# EAGLE design Double_Gen (EAGLE 7.0.0)
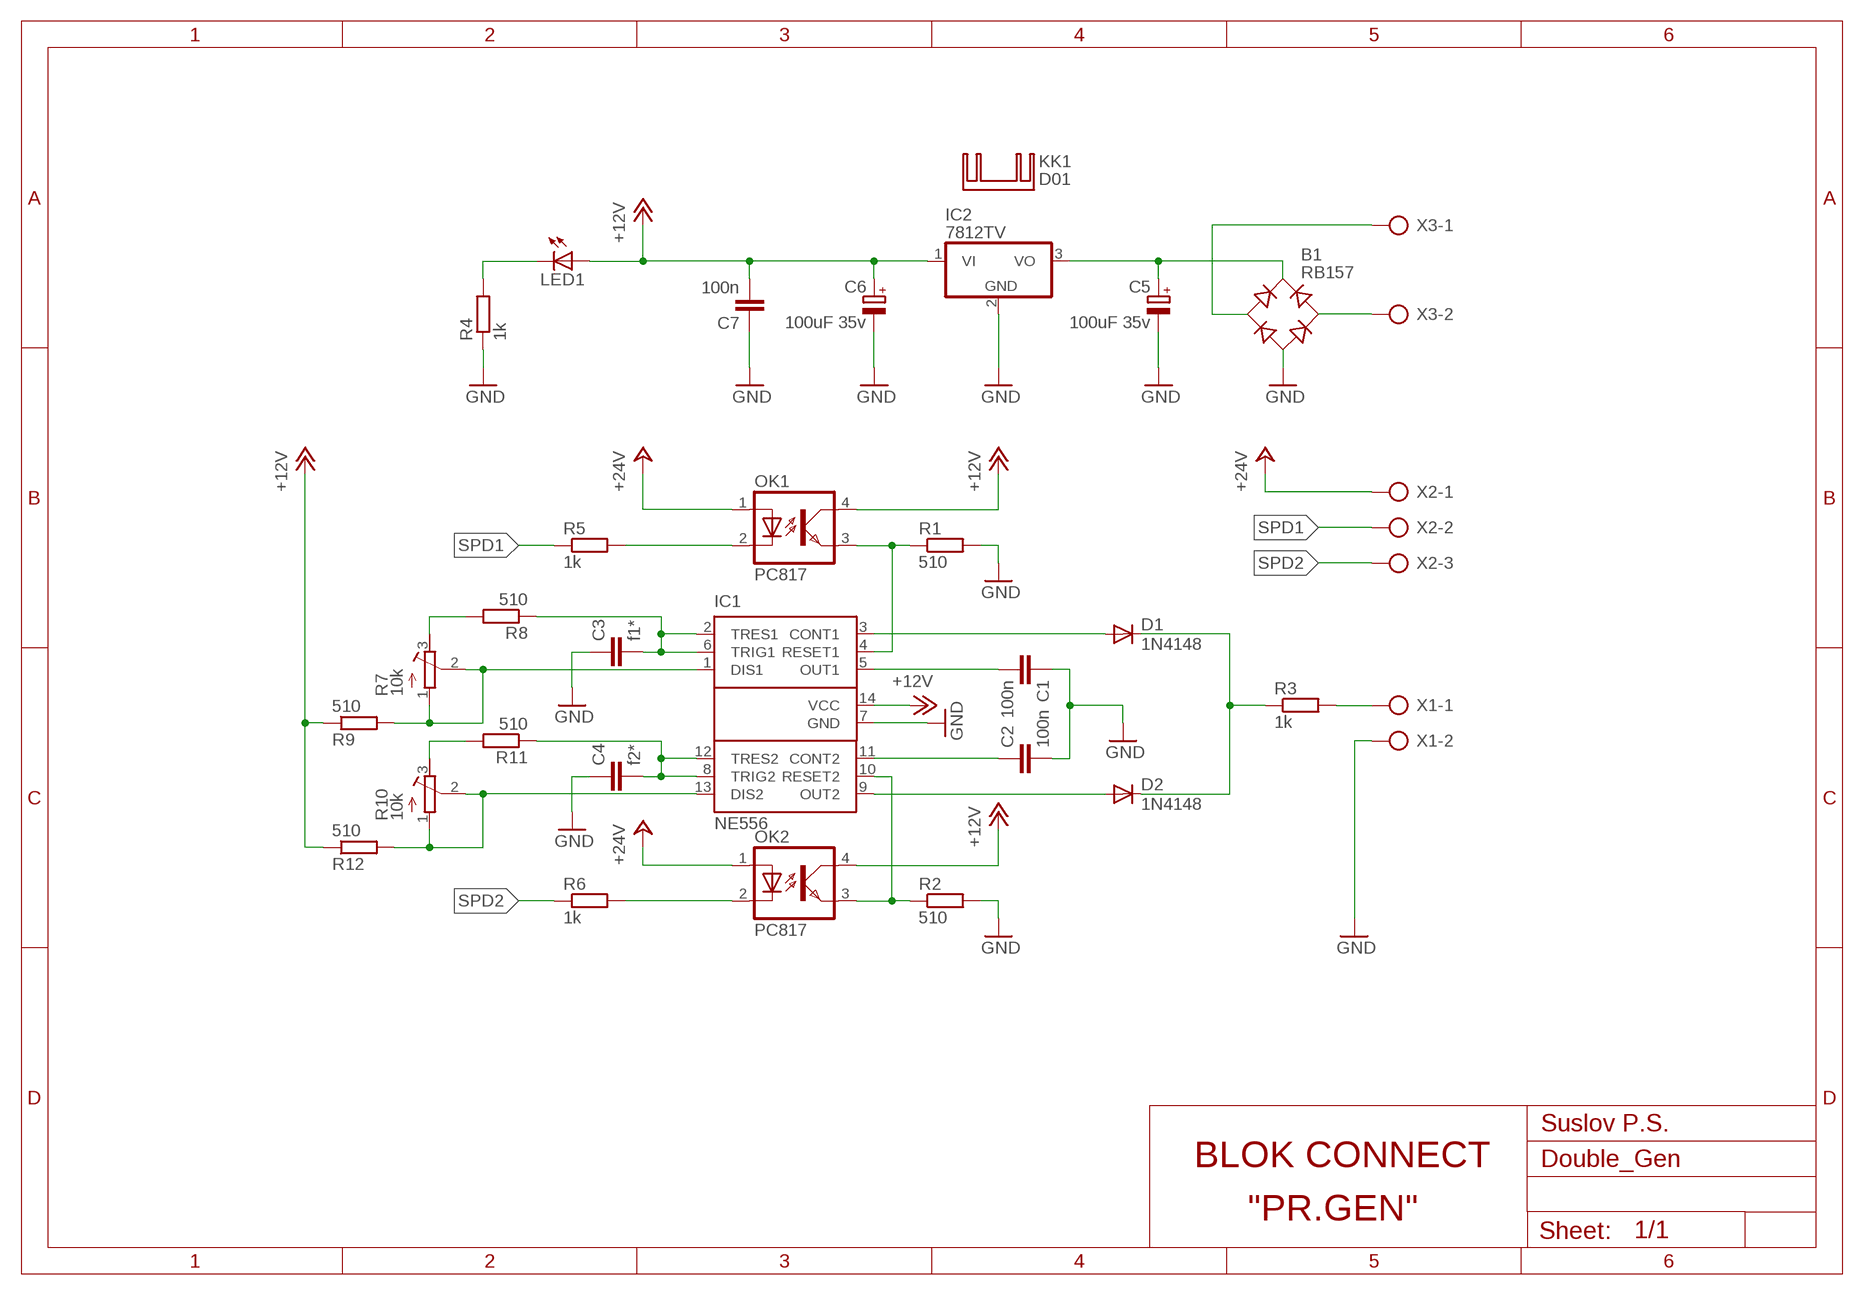
[diagram p0: schematic, sheet 1]

## Parts
B1  RB157  RB1A  [RB1A]
C1  100n  C-EU050-050X075  [C050-050X075]
C2  100n  C-EU050-050X075  [C050-050X075]
C3  f1*  C-EU050-050X075  [C050-050X075]
C4  f2*  C-EU050-050X075  [C050-050X075]
C5  100uF 35v  CPOL-EUE3.5-8  [E3,5-8]
C6  100uF 35v  CPOL-EUE3.5-8  [E3,5-8]
C7  100n  C-EU050-050X075  [C050-050X075]
D1  1N4148  1N4148DO35-7  [DO35-7]
D2  1N4148  1N4148DO35-7  [DO35-7]
IC1  NE556  [DIL14]
IC2  7812TV  [TO220V]
KK1  D01  D02S  [D02S]
LED1  LED5MM  [LED5MM]
OK1  PC817  [DIL04]
OK2  PC817  [DIL04]
R1  510  R-EU_0207/10  [0207/10]
R2  510  R-EU_0207/10  [0207/10]
R3  1k  R-EU_0207/10  [0207/10]
R4  1k  R-EU_0207/10  [0207/10]
R5  1k  R-EU_0207/10  [0207/10]
R6  1k  R-EU_0207/10  [0207/10]
R7  10k  R-TRIMM64W  [RTRIM64W]
R8  510  R-EU_0207/10  [0207/10]
R9  510  R-EU_0207/10  [0207/10]
R10  10k  R-TRIMM64W  [RTRIM64W]
R11  510  R-EU_0207/10  [0207/10]
R12  510  R-EU_0207/10  [0207/10]
X1  AK500/2  [AK500/2]
X2  AK500/3  [AK500/3]
X3  AK500/2  [AK500/2]

## Nets
+12V: C6.+ C7.1 IC1.14(VCC) IC2.1(VI) LED1.A OK1.4(COL) OK2.4(COL) R9.1 R12.1
+24V: OK1.1(A) OK2.1(A) X2.1
GND: B1.- C1.2 C2.2 C3.2 C4.2 C5.- C6.- C7.2 IC1.7(GND) IC2.2(GND) R1.2 R2.2 R4.1 X1.2
N$1: C1.1 IC1.5(OUT1)
N$2: C2.1 IC1.11(CONT2)
N$3: IC1.4(RESET1) OK1.3(EMIT) R1.1
N$4: IC1.10(RESET2) OK2.3(EMIT) R2.1
N$5: D1.A IC1.3(CONT1)
N$6: R3.2 X1.1
N$8: D2.A IC1.9(OUT2)
N$9: D1.C D2.C R3.1
N$10: OK1.2(C) R5.2
N$11: OK2.2(C) R6.2
N$12: B1.AC2 X3.2
N$13: R7.3(E) R8.2
N$14: C3.1 IC1.2(TRES1) IC1.6(TRIG1) R8.1
N$15: IC1.1(DIS1) R7.1(A) R7.2(S) R9.2
N$16: B1.AC1 X3.1
N$17: R10.3(E) R11.2
N$18: C4.1 IC1.8(TRIG2) IC1.12(TRES2) R11.1
N$19: IC1.13(DIS2) R10.1(A) R10.2(S) R12.2
N$20: B1.+ C5.+ IC2.3(VO)
N$22: LED1.K(C) R4.2
SPD1: R5.1 X2.2
SPD2: R6.1 X2.3

## Notes on the sheet
- Suslov P.S.
- BLOK CONNECT
- "PR.GEN"

## Library data of the parts
B1 = rectifier:RB1A: RECTIFIER 1 A
C1-C4 C7 = rcl:C-EU: CAPACITOR, European symbol
C5 C6 = rcl:CPOL-EU: POLARIZED CAPACITOR, European symbol
D1 D2 = diode:1N4148: DIODE high speed (Philips)
IC1 = st-microelectronics:NE556: General Purpose Biopolartimer; MPN: NE556; OC_FARNELL: 2349784; OC_NEWARK: 83C0108
IC2 = linear:78*: Positive VOLTAGE REGULATOR Source: http://cache.national.com/ds/LM/LM78L05.pdf http://www.fairchildsemi.com/ds/LM/LM7805.pdf
KK1 = heatsink:D02S: HEATSINK distributor Schukat
LED1 = led:LED: LED OSRAM: - CHIPLED LG R971, LG N971, LY N971, LG Q971, LY Q971, LO R971, LY R971 LH N974, LH R974 LS Q976, LO Q976, LY Q976 LO Q996 - Hyper CHIPLED LW Q18S LB Q993, LB Q99A, LB R99A - SideLED LS A670, LO A670, LY A670, LG A670, LP A670 LB A673, LV A673, LT A673, LW A673 LH A674 LY A675 LS A676, LA A676, LO A676, LY A676, LW A676 LS A679, LY A679, LG A679 - Hyper Micro SIDELED® LS Y876, LA Y876, LO Y876, LY Y876 LT Y87S - SmartLED LW L88C, LW L88S LB L89C, LB L89S, LG L890 LS L89K, LO L89K, LY L89K LS L896, LA L896, LO L896, LY L896 - TOPLED LS T670, LO T670, LY T670, LG T670, LP T670 LSG T670, LSP T670, LSY T670, LOP T670, LYG T670 LG T671, LOG T671, LSG T671 LB T673, LV T673, LT T673, LW T673 LH T674 LS T676, LA T676, LO T676, LY T676, LB T676, LH T676, LSB T676, LW T676 LB T67C, LV T67C, LT T67C, LS T67K, LO T67K, LY T67K, LW E67C LS E67B, LA E67B, LO E67B, LY E67B, LB E67C, LV E67C, LT E67C LW T67C LS T679, LY T679, LG T679 LS T770, LO T770, LY T770, LG T770, LP T770 LB T773, LV T773, LT T773, LW T773 LH T774 LS E675, LA E675, LY E675, LS T675 LS T776, LA T776, LO T776, LY T776, LB T776 LHGB T686 LT T68C, LB T68C - Hyper Mini TOPLED® LB M676 - Mini TOPLED Santana® LG M470 LS M47K, LO M47K, LY M47K Source: http://www.osram.convergy.de LUXEON: - LUMILED® LXK2-PW12-R00, LXK2-PW12-S00, LXK2-PW14-U00, LXK2-PW14-V00 LXK2-PM12-R00, LXK2-PM12-S00, LXK2-PM14-U00 LXK2-PE12-Q00, LXK2-PE12-R00, LXK2-PE12-S00, LXK2-PE14-T00, LXK2-PE14-U00 LXK2-PB12-K00, LXK2-PB12-L00, LXK2-PB12-M00, LXK2-PB14-N00, LXK2-PB14-P00, LXK2-PB14-Q00 LXK2-PR12-L00, LXK2-PR12-M00, LXK2-PR14-Q00, LXK2-PR14-R00 LXK2-PD12-Q00, LXK2-PD12-R00, LXK2-PD12-S00 LXK2-PH12-R00, LXK2-PH12-S00 LXK2-PL12-P00, LXK2-PL12-Q00, LXK2-PL12-R00 Source: www.luxeon.com KINGBRIGHT: KA-3528ASYC Source: www.kingbright.com
OK1 OK2 = optocoupler:PC817: SHARP OPTO COUPLER; MPN: PC817X4J000F; OC_FARNELL: 9707727; OC_NEWARK: 97K7059
R1-R6 R8 R9 R11 R12 = rcl:R-EU_: RESISTOR, European symbol
R7 R10 = rcl:R-TRIMM: Trimm resistor
X1 X3 = con-ptr500:AK500/2: CONNECTOR; OC_FARNELL: unknown; OC_NEWARK: unknown
X2 = con-ptr500:AK500/3: CONNECTOR; OC_FARNELL: unknown; OC_NEWARK: unknown

## Board
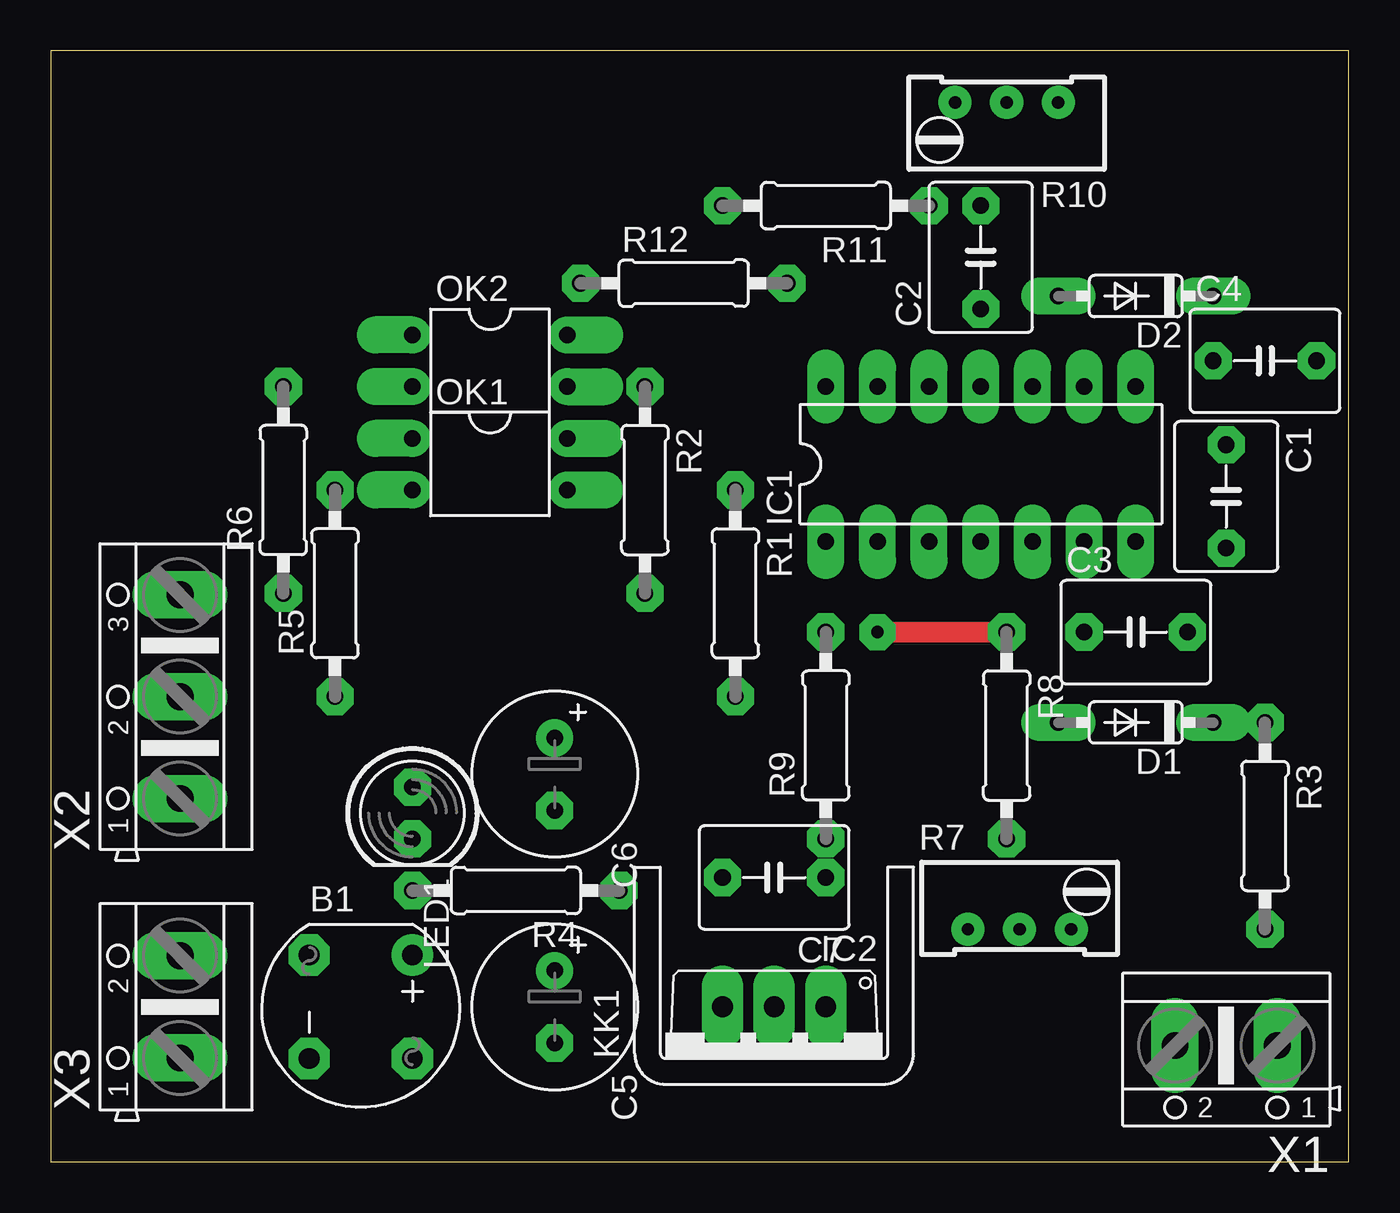
[diagram p1: board, top side]
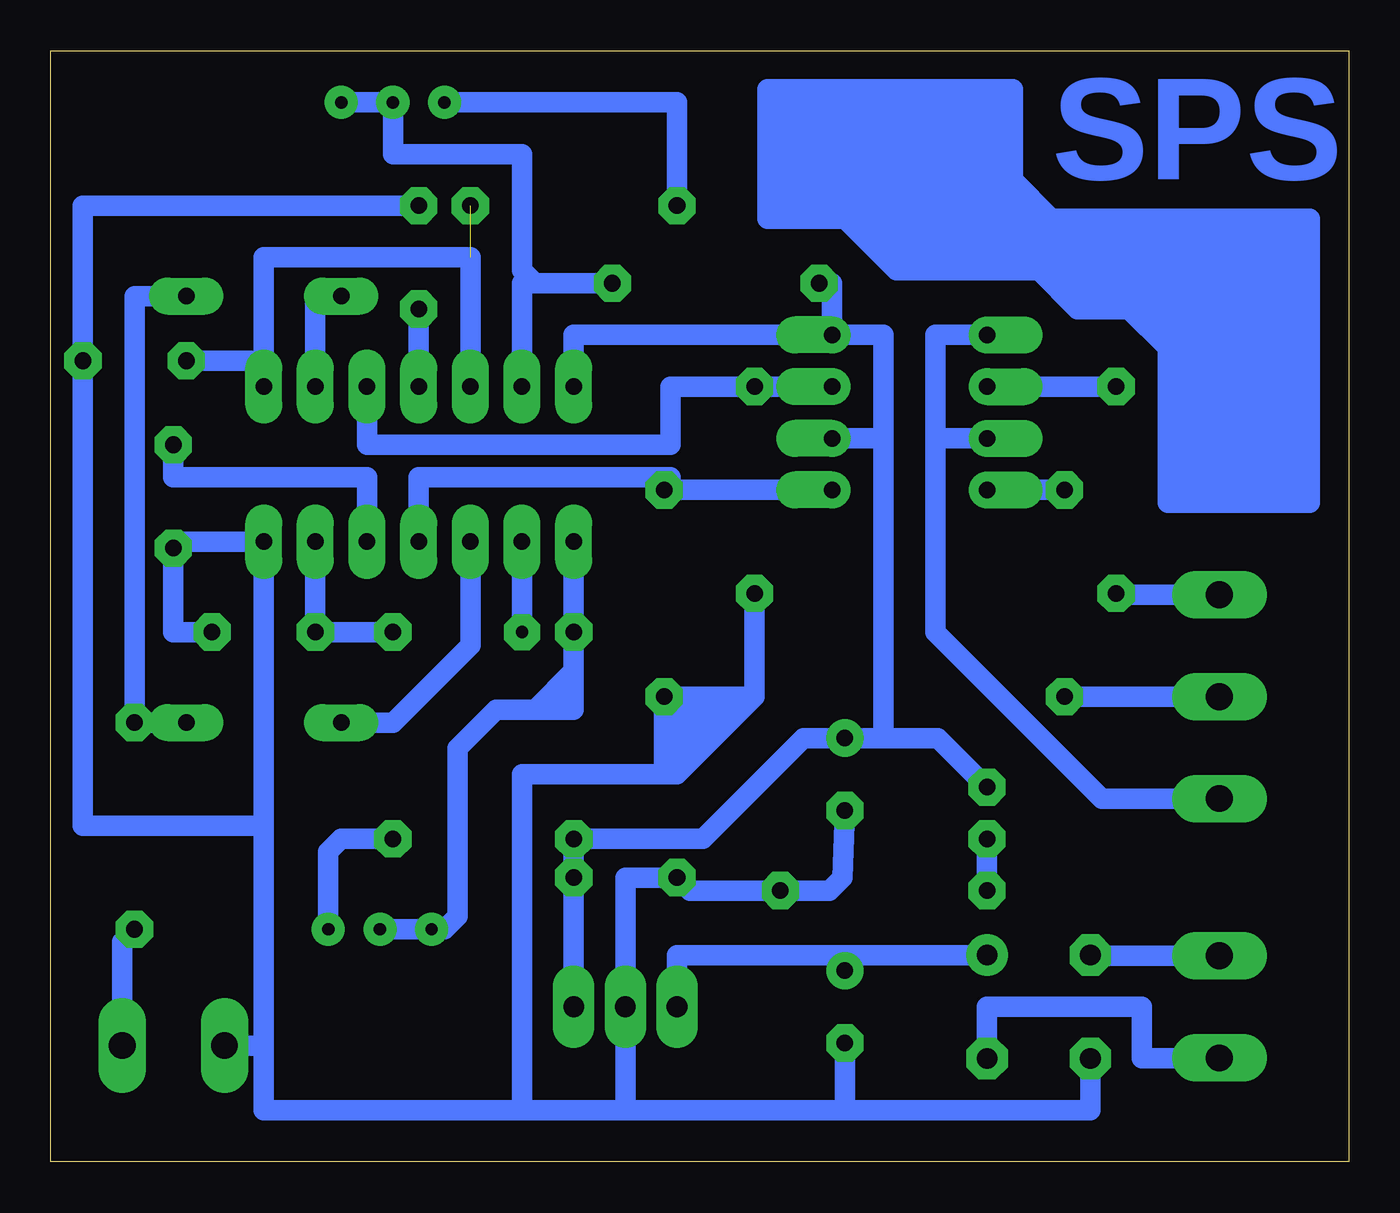
[diagram p2: board, bottom side, seen from below]

Size 63.8 x 54.6 mm. Coordinates in mm from the lower left corner, seen from the top.
Outline: 0,0 63.8,0 63.8,54.6 0,54.6 0,0
Copper layers (1*16): Top 0.035mm / dielectric 1.5mm / Bottom 0.035mm
Design rules "default *": minimum track width 10mil, minimum drill 24mil, track to track 8mil, track to pad 8mil, pad to pad 8mil, via to via 8mil, smd to smd 8mil, copper to edge 40mil, drill to drill 8mil, minimum pad ring 20mil, minimum via ring 8mil, stop-mask expansion 4mil, vias tented up to drill 0mil, thermal gap 10mil

### Footprints (pad centres in the part's own frame; a part is rotated, then mirrored left to right if it is on the bottom)
RB1A = drill 1.016: + -2.54,2.54 | drill 1.016 octagon: - 2.54,-2.54; AC1 2.54,2.54; AC2 -2.54,-2.54
C050-050X075 = drill 0.813 octagon: 1 -2.54,0; 2 2.54,0
E3,5-8 = drill 0.813 pad 1.6: + -1.778,0 | drill 0.813 pad 1.6 octagon: - 1.778,0
DO35-7 = drill 0.813 long: A 3.81,0; C -3.81,0
DIL14 = drill 0.813 long: 1 -7.62,-3.81; 2 -5.08,-3.81; 3 -2.54,-3.81; 4 0,-3.81; 5 2.54,-3.81; 6 5.08,-3.81; 7 7.62,-3.81; 8 7.62,3.81; 9 5.08,3.81; 10 2.54,3.81; 11 0,3.81; 12 -2.54,3.81; 13 -5.08,3.81; 14 -7.62,3.81
TO220V = drill 1.016 long: 1 -2.54,-2.54; 2 0,-2.54; 3 2.54,-2.54
LED5MM = drill 0.813 octagon: A -1.27,0; K 1.27,0
DIL04 = drill 0.813 offset: 1 -1.27,-3.81; 2 1.27,-3.81; 3 1.27,3.81; 4 -1.27,3.81
0207/10 = drill 0.813 octagon: 1 -5.08,0; 2 5.08,0
RTRIM64W = drill 0.61: 1 1.27,-2.54; 2 1.27,0; 3 1.27,2.54
AK500/2 = drill 1.321 long: 1 -2.515,0; 2 2.515,0
AK500/3 = drill 1.321 long: 1 -5.004,0; 2 0,0; 3 5.004,0

### Placement (x,y rotation side)
B1  15.24,7.62 270 top
C1  57.78,32.7 270 top
C2  45.72,44.45 90 top
C3  53.34,26.04 0 top
C4  59.69,39.37 0 top
C5  24.77,7.62 270 top
C6  24.77,19.05 270 top
C7  35.56,13.97 180 top
D1  53.34,21.59 180 top
D2  53.34,42.55 180 top
IC1  45.72,34.29 0 top
IC2  35.56,5.08 180 top
KK1  35.56,5.08 0 top
LED1  17.78,17.14 270 top
OK1  21.59,34.29 270 top
OK2  21.59,39.37 270 top
R1  33.66,27.94 270 top
R2  29.21,33.02 270 top
R3  59.69,16.51 270 top
R4  22.86,13.33 180 top
R5  13.97,27.94 90 top
R6  11.43,33.02 90 top
R7  47.62,12.7 270 top
R8  46.99,20.95 270 top
R9  38.1,20.95 90 top
R10  46.99,50.8 90 top
R11  38.1,46.99 180 top
R12  31.11,43.18 0 top
X1  57.78,5.71 180 top
X2  6.35,22.86 90 top
X3  6.35,7.62 90 top

### Tracks (layer width: path | path; a pad name or v marks a point on that pad's centre or on a via)
+12V
  Bottom 1.016: IC2.1 C7.1 R9.1 31.75,15.88 26.8,20.83 C6.+ 22.86,20.83 | OK2.4 22.86,40.64 22.86,35.56 | OK1.4 22.86,35.56 | 22.86,35.56 22.86,20.83 | IC1.14 38.1,40.64 OK2.4 | OK2.4 25.4,43.18 R12.1 | LED1.A 20.19,20.83 22.86,20.83
+24V
  Bottom 1.016: X2.1 12.14,17.86 20.32,26.04 20.32,35.56 | 20.32,35.56 20.32,40.64 OK2.1 | OK1.1 20.32,35.56
GND
  Bottom 1.016: B1.- 12.7,2.54 24.77,2.54 | 24.77,2.54 C5.- | 35.56,2.54 IC2.2 35.56,13.97 C7.2 32.38,13.33 R4.1 25.53,13.33 24.89,13.97 C6.- | 35.56,2.54 24.77,2.54 | 33.02,22.86 R1.2 33.66,22.22 | 31.75,22.86 30.48,22.86 | 29.21,22.86 R2.2 | 53.34,16.51 IC1.7 57.78,30.48 C1.2 57.78,26.04 C3.2 | 53.34,16.51 53.34,5.71 | 53.34,5.71 53.34,2.54 40.64,2.54 | 40.64,2.54 35.56,2.54 | X1.2 53.34,5.71 | 40.64,2.54 40.64,19.05 33.66,19.05 | 33.66,22.22 33.66,20.95 | 33.66,19.68 33.66,19.05 | 53.34,16.51 62.23,16.51 C4.2 62.23,46.99 C2.2 | 33.66,19.05 33.02,19.05 29.21,22.86 | 29.21,22.86 30.48,22.86 | 30.48,22.86 33.66,19.68 | 33.66,19.68 33.66,20.95 | 33.66,20.95 31.75,22.86 | 31.75,22.86 33.02,22.86 | 33.02,22.86 33.66,22.22
N$1
  Bottom 1.016: IC1.5 48.26,33.66 57.78,33.66 C1.1
N$2
  Bottom 1.016: C2.1 IC1.11
N$3
  Bottom 1.016: OK1.3 R1.1 33.34,33.02 33.34,33.66 45.72,33.66 IC1.4
N$4
  Bottom 1.016: OK2.3 R2.1 33.34,38.1 33.34,35.24 48.26,35.24 IC1.10
N$5
  Bottom 1.016: IC1.3 43.18,25.4 46.99,21.59 D1.A
N$6
  Bottom 1.016: X1.1 60.3,10.82 R3.2
N$7
  Bottom 1.016: 1.91,46.36 14.61,46.36 16.51,48.26 16.51,52.71 28.57,52.71 28.57,46.36 24.77,46.36 22.23,43.82 15.24,43.82 13.34,41.91 10.79,41.91 8.89,40.01 8.89,32.38 1.91,32.38 1.91,46.36
N$8
  Bottom 1.016: IC1.9 50.8,42.55 D2.A
N$9
  Bottom 1.016: D2.C 59.69,42.55 59.69,26.04 R3.1 D1.C
N$10
  Bottom 1.016: R5.2 OK1.2
N$11
  Bottom 1.016: R6.2 OK2.2
N$12
  Bottom 1.016: X3.2 12.7,10.13 B1.AC2
N$13
  Bottom 1.016: R8.2 49.53,15.88 50.16,15.24 R7.3
N$14  (via drill 0.6 pad 1.78)
  Top 1.016: v40.64,26.04 R8.1
  Bottom 1.016: IC1.6 C3.1 R8.1 | IC1.2 v40.64,26.04
  other vias: 46.99,26.04
N$15
  Bottom 1.016: 40.01,22.22 39.37,22.22 | 39.37,22.22 38.1,22.22 38.1,23.5 | 38.1,24.13 R9.2 IC1.1 | R7.2 R7.1 44.45,11.43 43.81,12.06 43.81,20.32 41.91,22.22 40.01,22.22 | 40.01,22.22 38.1,24.13 | 38.1,24.13 38.1,23.5 | 38.1,23.5 39.37,22.22
N$16
  Bottom 1.016: B1.AC1 17.78,7.62 10.16,7.62 10.16,5.08 6.35,5.08 X3.1
N$17
  Bottom 1.016: R10.3 33.02,52.07 R11.2
N$18  (1 unrouted)
  Bottom 1.016: IC1.12 43.18,44.45 53.34,44.45 53.34,38.74 | IC1.8 53.34,38.74 | C4.1 53.98,39.37 53.34,38.74
N$19
  Bottom 1.016: R12.2 40.01,43.18 | 40.01,43.18 40.64,43.18 IC1.13 40.64,37.47 | R10.1 R10.2 46.99,49.53 40.64,49.53 40.64,43.82 40.01,43.18
N$20
  Bottom 1.016: B1.+ 24.77,10.16 | 24.77,10.16 C5.+ | IC2.3 33.02,10.16 24.77,10.16
N$21
  Bottom 1.016: 7.62,39.37 7.62,40.01 10.16,42.55 12.7,42.55 17.78,47.62 16.51,47.62 15.24,46.36 19.05,46.36 20.95,44.45 21.59,44.45 24.77,47.62
N$22
  Bottom 1.016: LED1.K R4.2
SPD1
  Bottom 1.016: X2.2 R5.1
SPD2
  Bottom 1.016: X2.3 11.35,27.86 R6.1
(copper drawn outside any net)
  shapes: Bottom area x4

### Text on the board
Bottom: SPS